# EAGLE design Center panel V1.1 (EAGLE 7.6.0)
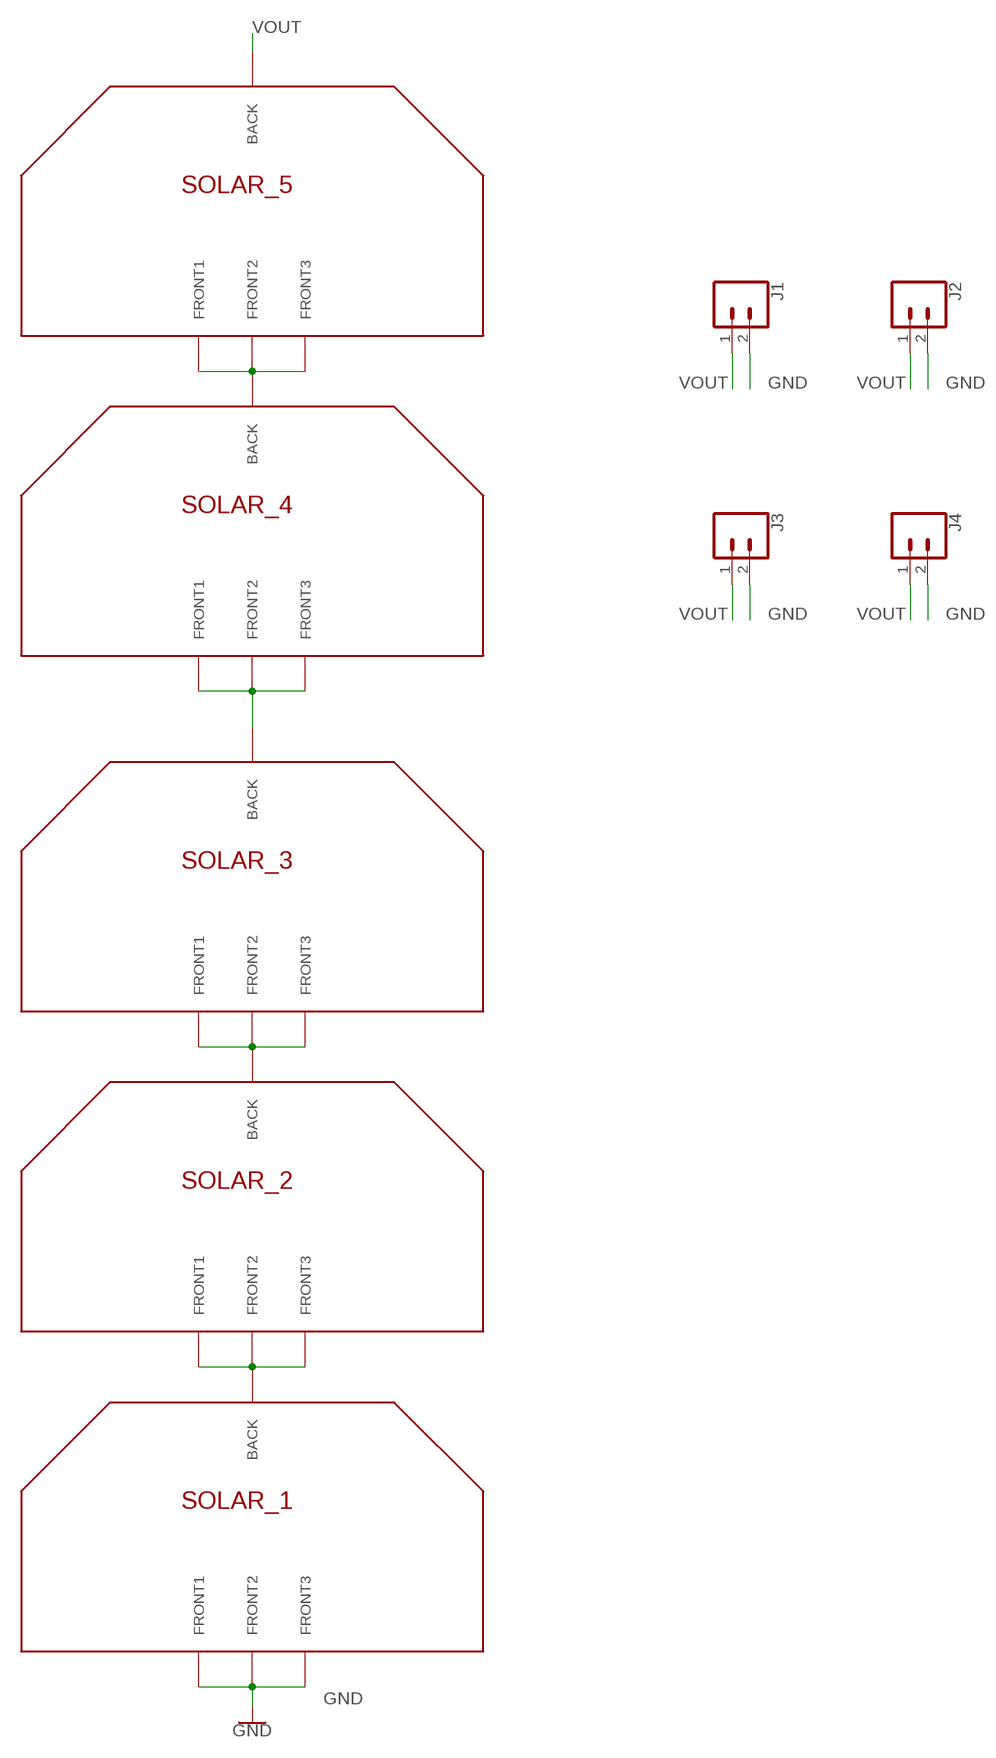
[diagram p0: schematic, sheet 1]

## Parts
J1  CONN_02  [1X02]
J2  CONN_02  [1X02]
J3  CONN_02  [1X02]
J4  CONN_02  [1X02]
SOLAR_1  SOLAR_CELL_HALF_TABS  [SOLAR_CELL_3G30A_HALF_TAB]
SOLAR_2  SOLAR_CELL_HALF_TABS  [SOLAR_CELL_3G30A_HALF_TAB]
SOLAR_3  SOLAR_CELL_HALF_TABS  [SOLAR_CELL_3G30A_HALF_TAB]
SOLAR_4  SOLAR_CELL_HALF_TABS  [SOLAR_CELL_3G30A_HALF_TAB]
SOLAR_5  SOLAR_CELL_HALF_TABS  [SOLAR_CELL_3G30A_HALF_TAB]

## Nets
1-2 [PANEL]: SOLAR_1.P$1(BACK) SOLAR_2.P$F1(FRONT1) SOLAR_2.P$F2(FRONT2) SOLAR_2.P$F3(FRONT3)
2-3 [PANEL]: SOLAR_2.P$1(BACK) SOLAR_3.P$F1(FRONT1) SOLAR_3.P$F2(FRONT2) SOLAR_3.P$F3(FRONT3)
3-4 [PANEL]: SOLAR_3.P$1(BACK) SOLAR_4.P$F1(FRONT1) SOLAR_4.P$F2(FRONT2) SOLAR_4.P$F3(FRONT3)
4-5 [PANEL]: SOLAR_4.P$1(BACK) SOLAR_5.P$F1(FRONT1) SOLAR_5.P$F2(FRONT2) SOLAR_5.P$F3(FRONT3)
GND [PANEL]: J1.2 J2.2 J3.2 J4.2 SOLAR_1.P$F1(FRONT1) SOLAR_1.P$F2(FRONT2) SOLAR_1.P$F3(FRONT3)
VOUT [PANEL]: J1.1 J2.1 J3.1 J4.1 SOLAR_5.P$1(BACK)

## Library data of the parts
J1-J4 = SparkFun-Connectors:CONN_02: Multi connection point. Often used as Generic Header-pin footprint for 0.1 inch spaced/style header connections On any of the 0.1 inch spaced packages, you can populate with these: Break Away Headers - Straight <https://www.sparkfun.com/products/116> (PRT-00116) Break Away Male Headers - Right Angle <https://www.sparkfun.com/products/553> (PRT-00553) Female Headers <https://www.sparkfun.com/products/115> (PRT-00115) Break Away Headers - Machine Pin <https://www.sparkfun.com/products/117> (PRT-00117) Break Away Female Headers - Swiss Machine Pin <https://www.sparkfun.com/products/743> (PRT-00743) For SCREWTERMINALS and SPRING TERMINALS visit here: Screw Terimnals on SparkFun.com <https://www.sparkfun.com/search/results?term=Screw+Terminals> (5mm/3.5mm/2.54mm spacing) This device is also useful as a general connection point to wire up your design to another part of your project. Our various solder wires solder well into these plated through hole pads. Hook-Up Wire - Assortment (Stranded, 22 AWG) <https://www.sparkfun.com/products/11375> (PRT-11375) Hook-Up Wire - Assortment (Solid Core, 22 AWG) <https://www.sparkfun.com/products/11367> (PRT-11367) View the entire wire category on our website here <https://www.sparkfun.com/categories/141> Special notes: Molex polarized connector foot print use with: PRT-08233 with associated crimp pins and housings. 2.54_SCREWTERM for use with PRT-10571. 3.5mm Screw Terminal footprints for PRT-08084 5mm Screw Terminal footprints for use with PRT-08432
SOLAR_1-SOLAR_5 = CubeSat(V2.3):SOLAR_CELL_HALF_TABS

## Net classes
1 PANEL: width 0.635 mm, drill 0.254 mm, clearance 0.381 mm

## Board
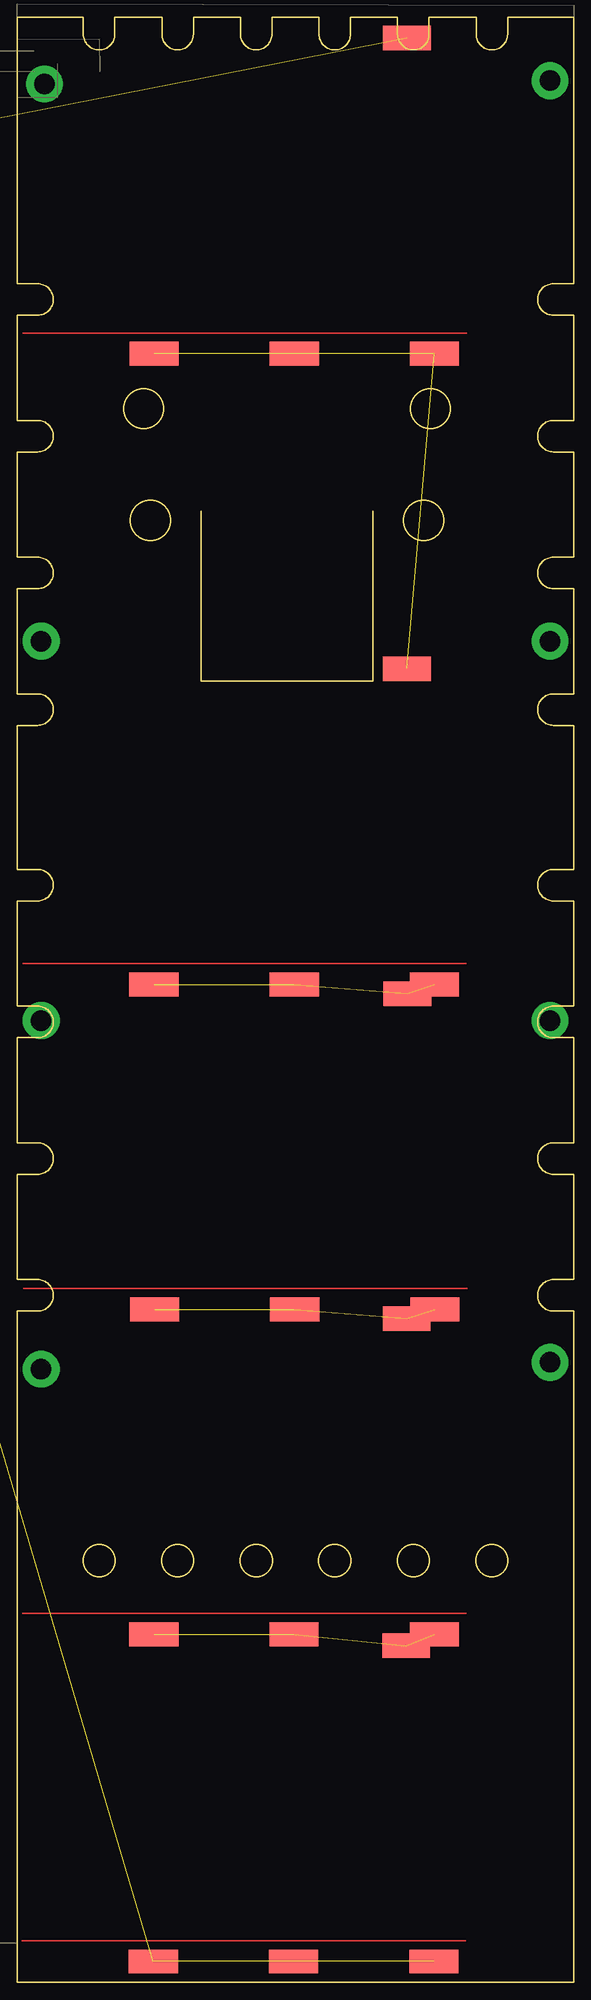
[diagram p1: board, top side]

Size 81.5 x 287.5 mm. Coordinates in mm from the lower left corner, seen from the top.
Outline: 26.96,215.21 26.96,190.34 52.06,190.34 52.06,215.21
Outline: 78.5,122.81 81.5,122.81 81.5,138.21 78.5,138.21 arc-180 78.5,142.81 81.5,142.81 81.5,158.21 78.5,158.21 arc-180 78.5,162.81 81.5,162.81 81.5,183.89 78.5,183.89 arc-180 78.5,188.49 81.5,188.49 81.5,203.89 78.5,203.89 arc-180 78.5,208.49 81.5,208.49 81.5,223.89 78.5,223.89 arc-180 78.5,228.49 81.5,228.49 81.5,243.89 78.5,243.89 arc-180 78.5,248.49 81.5,248.49 81.5,287.5 71.8,287.5 71.8,285 arc-180 67.2,285 67.2,287.5 60.3,287.5 60.3,285 arc-180 55.7,285 55.7,287.5 48.8,287.5 48.8,285 arc-180 44.2,285 44.2,287.5 37.3,287.5 37.3,285 arc-180 32.7,285 32.7,287.5 25.8,287.5 25.8,285 arc-180 21.2,285 21.2,287.5 14.3,287.5 14.3,285 arc-180 9.7,285 9.7,287.5 0,287.5 0,248.49 3,248.49 arc-180 3,243.89 0,243.89 0,228.49 3,228.49 arc-180 3,223.89 0,223.89 0,208.49 3,208.49 arc-180 3,203.89 0,203.89 0,188.49 3,188.49 arc-180 3,183.89 0,183.89 0,162.81 3,162.81 arc-180 3,158.21 0,158.21 0,142.81 3,142.81 arc-180 3,138.21 0,138.21 0,122.81 3,122.81 arc-180 3,118.21 0,118.21 0,102.81 3,102.81 arc-180 3,98.21 0,98.21 0,0 81.5,0 81.5,98.21 78.5,98.21 arc-180 78.5,102.81 81.5,102.81 81.5,118.21 78.5,118.21 arc-180 78.5,122.81
Outline: circle at 23.5,61.7 radius 2.3
Outline: circle at 12,61.7 radius 2.3
Outline: circle at 35,61.7 radius 2.3
Outline: circle at 46.5,61.7 radius 2.3
Outline: circle at 58,61.7 radius 2.3
Outline: circle at 69.5,61.7 radius 2.3
Outline: circle at 59.51,213.88 radius 2.89
Outline: circle at 60.51,230.21 radius 2.89
Outline: circle at 19.51,213.88 radius 2.89
Outline: circle at 18.51,230.21 radius 2.89
Copper layers (1*16): Top 0.035mm / dielectric 1.5mm / Bottom 0.035mm
Design rules "default": minimum track width 10mil, minimum drill 24mil, track to track 8mil, track to pad 8mil, pad to pad 8mil, via to via 8mil, smd to smd 8mil, copper to edge 40mil, drill to drill 8mil, minimum pad ring 10mil, minimum via ring 8mil, stop-mask expansion 4mil, vias tented up to drill 0mil, thermal gap 10mil

### Footprints (pad centres in the part's own frame; a part is rotated, then mirrored left to right if it is on the bottom)
1X02 = drill 1.016 pad 1.88: 1 0,0; 2 2.54,0
SOLAR_CELL_3G30A_HALF_TAB = smd 7 x 3.6: P$1 24.49,19.02 | smd 7.2 x 3.5: P$F1 -12.51,-27.185; P$F2 8.01,-27.185; P$F3 28.54,-27.185

### Placement (x,y rotation side)
J1  -7.5,271.73 180 top  (outside the outline)
J2  -10.1,112.96 180 top  (outside the outline)
J3  -9.77,264.33 0 top  (outside the outline)
J4  -12.12,120.97 0 top  (outside the outline)
SOLAR_1  32.45,30.24 0 top
SOLAR_2  32.54,78.08 0 top
SOLAR_3  32.63,125.62 0 top
SOLAR_4  32.54,173.15 0 top
SOLAR_5  32.56,265.42 0 top

### Tracks (layer width: path | path; a pad name or v marks a point on that pad's centre or on a via)
1-2  (3 unrouted)
2-3  (3 unrouted)
3-4  (3 unrouted)
4-5  (3 unrouted)
GND  (6 unrouted)
N$1  (via drill 3 pad 5.4)
  other vias: 3.51,140.71
N$2  (via drill 3 pad 5.4)
  other vias: 3.51,196.21
N$3  (via drill 3 pad 5.4)
  other vias: 4.01,277.71
N$4  (via drill 3 pad 5.4)
  other vias: 3.51,89.71
N$5  (via drill 3 pad 5.4)
  other vias: 78.01,90.71
N$6  (via drill 3 pad 5.4)
  other vias: 78.01,140.71
N$7  (via drill 3 pad 5.4)
  other vias: 78.01,196.21
N$8  (via drill 3 pad 5.4)
  other vias: 78.01,278.21
VOUT  (4 unrouted)